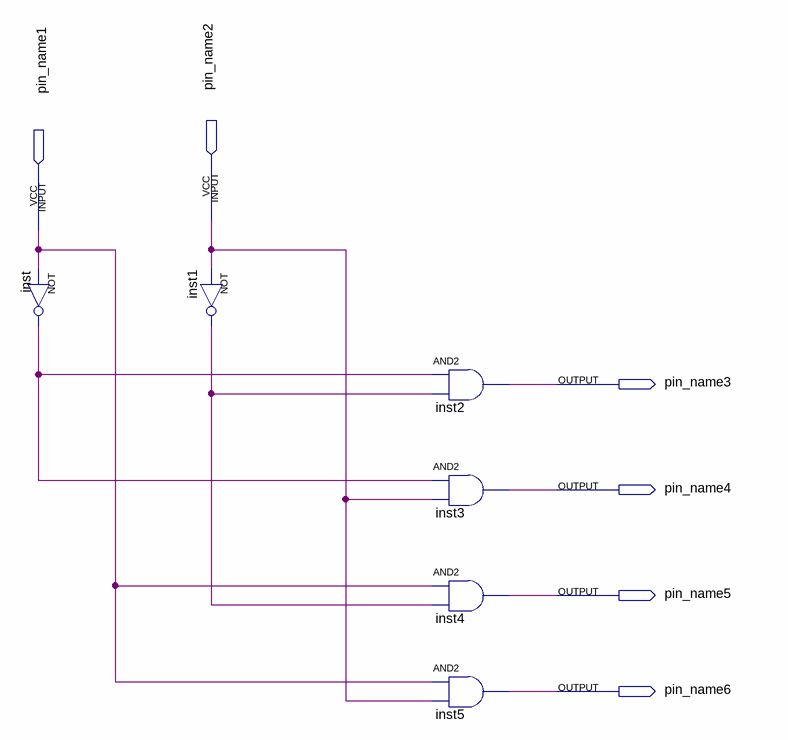
[diagram p0: schematic sheet]
// Quartus schematic LALOG-cesar-projeto1.bdf as structural Verilog: 6 symbols, 6 pins
module \LALOG-cesar-projeto1  (
  input  pin_name2,
  input  pin_name1,
  output pin_name3,
  output pin_name4,
  output pin_name5,
  output pin_name6
);

  wire inst1_out, inst_out;

  not inst (inst_out, pin_name1);
  not inst1 (inst1_out, pin_name2);
  and inst2 (pin_name3, inst_out, inst1_out);
  and inst3 (pin_name4, inst_out, pin_name2);
  and inst4 (pin_name5, pin_name1, inst1_out);
  and inst5 (pin_name6, pin_name1, pin_name2);
endmodule
